# EAGLE design ledhub_r3 (EAGLE 9.6.2)
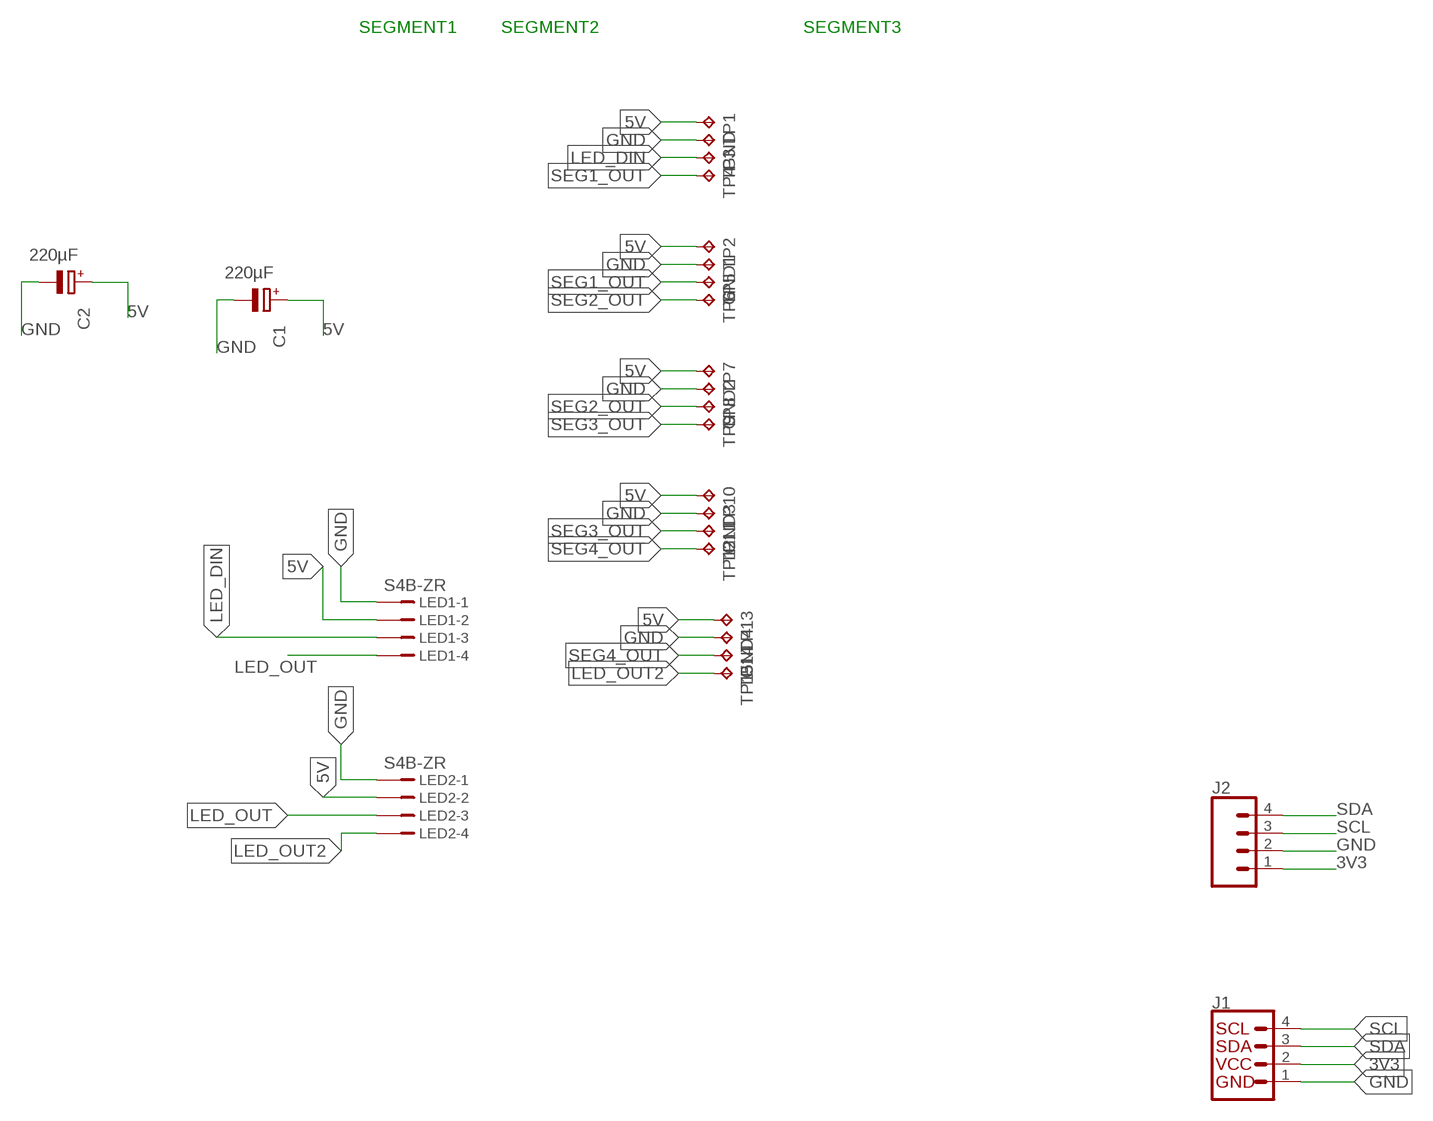
[diagram p0: schematic, sheet 1]

## Parts
C1  220µF  CPOL-EUD  [PANASONIC_D]
C2  220µF  CPOL-EUD  [PANASONIC_D]
GND  TPTP15SQ  [TP15SQ]
GND1  TPTP15SQ  [TP15SQ]
GND2  TPTP15SQ  [TP15SQ]
GND3  TPTP15SQ  [TP15SQ]
GND4  TPTP15SQ  [TP15SQ]
J1  QWIIC_CONNECTORJS-1MM  [1X04_1MM_RA]
J2  CONN_04  [1X04]
LED1  S4B-ZR  [S4B-ZR]
LED2  S4B-ZR  [S4B-ZR]
TP1  TPTP15R  [TP15R]
TP2  TPTP15R  [TP15R]
TP3  TPTP15R  [TP15R]
TP4  TPTP15R  [TP15R]
TP5  TPTP15R  [TP15R]
TP6  TPTP15R  [TP15R]
TP7  TPTP15R  [TP15R]
TP8  TPTP15R  [TP15R]
TP9  TPTP15R  [TP15R]
TP10  TPTP15R  [TP15R]
TP11  TPTP15R  [TP15R]
TP12  TPTP15R  [TP15R]
TP13  TPTP15R  [TP15R]
TP14  TPTP15R  [TP15R]
TP15  TPTP15R  [TP15R]

## Nets
3V3: J1.2(VCC) J2.1
5V: C1.+ C2.+ LED1.2 LED2.2 TP1.TP TP2.TP TP7.TP TP10.TP TP13.TP
GND: C1.- C2.- GND1.TP GND2.TP GND3.TP GND4.TP GND.TP J1.1(GND) J2.2 LED1.1 LED2.1
LED_DIN: LED1.3 TP3.TP
LED_OUT: LED1.4 LED2.3
LED_OUT2: LED2.4 TP15.TP
SCL: J1.4(SCL) J2.3
SDA: J1.3(SDA) J2.4
SEG1_OUT: TP4.TP TP5.TP
SEG2_OUT: TP6.TP TP8.TP
SEG3_OUT: TP9.TP TP11.TP
SEG4_OUT: TP12.TP TP14.TP

## Notes on the sheet
- SEGMENT1 | SEGMENT2 | SEGMENT3

## Library data of the parts
C1 C2 = rcl:CPOL-EU: POLARIZED CAPACITOR, European symbol; SPICEPREFIX: C
GND GND1-GND4 TP1-TP15 = testpad:TP: Test pad
J1 = SparkFun-Connectors:QWIIC_CONNECTOR: SparkFun I2C Standard Qwiic Connector An SMD 1mm pitch JST connector makes it easy and quick (get it? Qwiic?) to connect I2C devices to each other. The Qwiic system <http://www.sparkfun.com/qwiic> enables fast and solderless connection between popular platforms and various sensors and actuators. We carry 200mm <https://www.sparkfun.com/products/14204>, 100mm <https://www.sparkfun.com/products/14205>, 50mm <https://www.sparkfun.com/products/14206>, and breadboard friendly <https://www.sparkfun.com/products/14207> Qwiic cables. We also offer 10 pcs strips <https://www.sparkfun.com/products/14323> the SMD connectors.
J2 = SparkFun-Connectors:CONN_04: Multi connection point. Often used as Generic Header-pin footprint for 0.1 inch spaced/style header connections On any of the 0.1 inch spaced packages, you can populate with these: Break Away Headers - Straight <https://www.sparkfun.com/products/116> (PRT-00116) Break Away Male Headers - Right Angle <https://www.sparkfun.com/products/553> (PRT-00553) Female Headers <https://www.sparkfun.com/products/115> (PRT-00115) Break Away Headers - Machine Pin <https://www.sparkfun.com/products/117> (PRT-00117) Break Away Female Headers - Swiss Machine Pin <https://www.sparkfun.com/products/743> (PRT-00743) For SCREWTERMINALS and SPRING TERMINALS visit here: Screw Terimnals on SparkFun.com <https://www.sparkfun.com/search/results?term=Screw+Terminals> (5mm/3.5mm/2.54mm spacing) This device is also useful as a general connection point to wire up your design to another part of your project. Our various solder wires solder well into these plated through hole pads. Hook-Up Wire - Assortment (Stranded, 22 AWG) <https://www.sparkfun.com/products/11375> (PRT-11375) Hook-Up Wire - Assortment (Solid Core, 22 AWG) <https://www.sparkfun.com/products/11367> (PRT-11367) View the entire wire category on our website here <https://www.sparkfun.com/categories/141> Special notes: Molex polarized connector foot print use with SKU : PRT-08231 with associated crimp pins and housings. 1MM SMD Version SKU: PRT-10208; PROD_ID: CONN-09696
LED1 LED2 = con-jst:?4B-ZR: ZH CONNECTOR 1.5 mm, 4 pin 1 row Source: http://www.jst.com .. eZH.pdf; MF: FARNELL; MPN: S4B-ZR(LF)(SN); OC_FARNELL: 9491830; OC_NEWARK: 38K8076

## Net classes
0 default: width 0.279 mm, clearance 0.229 mm

## Board
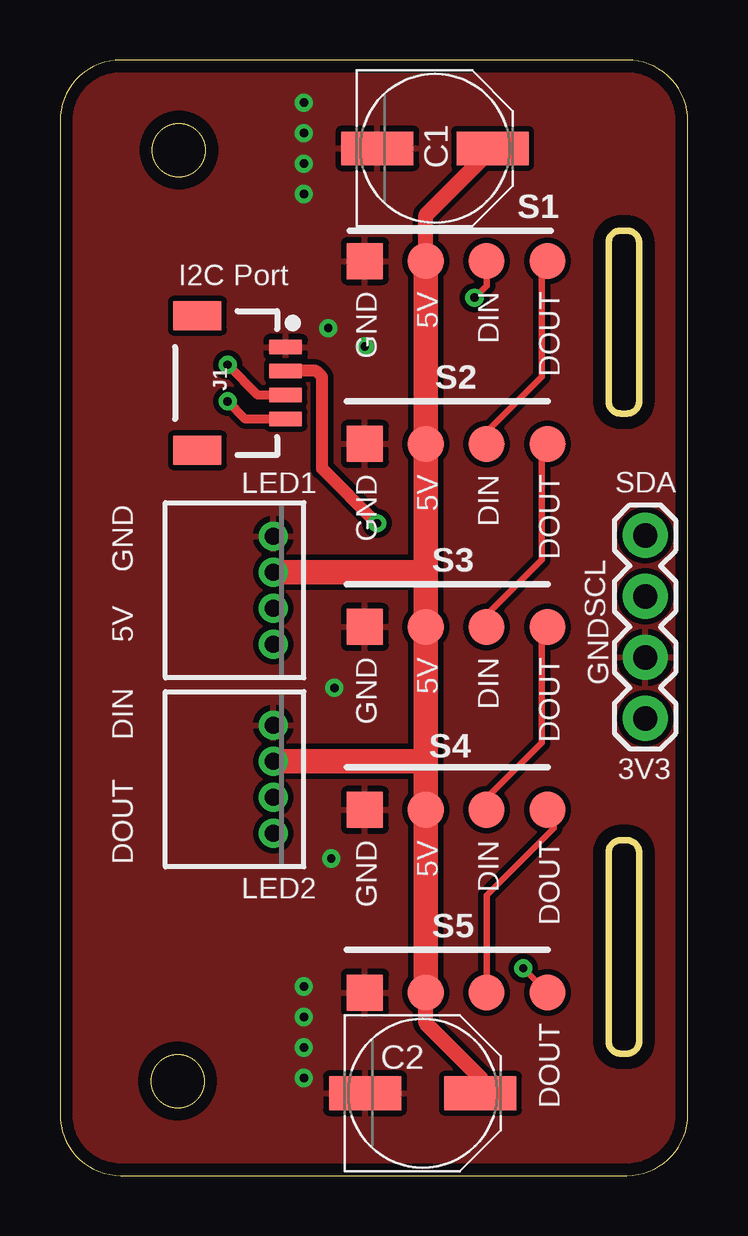
[diagram p1: board, top side]
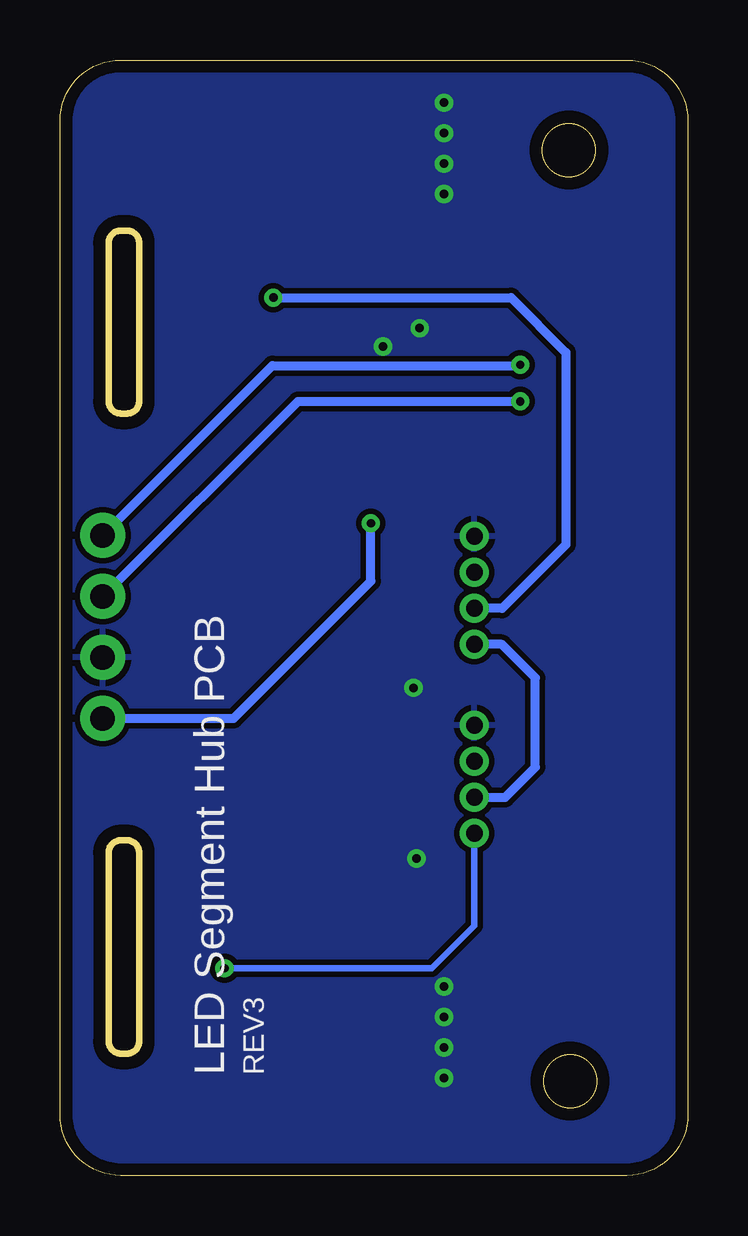
[diagram p2: board, bottom side, seen from below]

Size 26.16 x 46.48 mm. Coordinates in mm from the lower left corner, seen from the top.
Outline: 0,43.94 0,2.54 arc90 2.54,0 23.62,0 arc90 26.16,2.54 26.16,43.94 arc90 23.62,46.48 2.54,46.48 arc90 0,43.94
Outline: 24.13,38.86 24.13,32.26 arc-90 23.62,31.75 23.37,31.75 arc-90 22.86,32.26 22.86,38.86 arc-90 23.37,39.37 23.62,39.37 arc-90 24.13,38.86
Outline: 24.13,13.46 24.13,5.59 arc-90 23.62,5.08 23.37,5.08 arc-90 22.86,5.59 22.86,13.46 arc-90 23.37,13.97 23.62,13.97 arc-90 24.13,13.46
Outline: circle at 4.95,42.72 radius 1.1
Outline: circle at 4.9,3.94 radius 1.1
Copper layers (1*16): Top 0.035mm / dielectric 1.5mm / Bottom 0.035mm
Design rules "default *": minimum track width 6mil, minimum drill 0.35mm, track to track 6mil, track to pad 6mil, pad to pad 6mil, via to via 6mil, smd to smd 6mil, copper to edge 20mil, drill to drill 6mil, minimum pad ring 10mil, minimum via ring 8mil, stop-mask expansion 4mil, vias tented up to drill 2mm, thermal gap 10mil

### Footprints (pad centres in the part's own frame; a part is rotated, then mirrored left to right if it is on the bottom)
PANASONIC_D = smd 3 x 1.4: + 2.4,0; - -2.4,0
TP15SQ = smd 1.5 x 1.5: TP 0,0
1X04_1MM_RA = smd 0.6 x 1.35: 1 -1.5,0; 2 -0.5,0; 3 0.5,0; 4 1.5,0 | smd 1.2 x 2: NC1 2.8,-3.675; NC2 -2.8,-3.675
1X04 = drill 1.016 pad 1.88: 1 0,0; 2 2.54,0; 3 5.08,0; 4 7.62,0
S4B-ZR = drill 0.7 pad 1.1: 1 -2.25,0; 2 -0.75,0; 3 0.75,0; 4 2.25,0
TP15R = smd 1.5 x 1.5: TP 0,0

### Placement (x,y rotation side)
C1  15.62,42.8 0 top
C2  15.11,3.43 0 top
GND  12.7,38.1 0 top
GND1  12.7,30.48 0 top
GND2  12.7,22.86 0 top
GND3  12.7,15.24 0 top
GND4  12.7,7.62 0 top
J1  9.4,33.02 270 top
J2  24.38,19.05 90 top
LED1  8.89,24.38 270 top
LED2  8.89,16.51 270 top
TP1  15.24,38.1 0 top
TP2  15.24,30.48 0 top
TP3  17.78,38.1 0 top
TP4  20.32,38.1 0 top
TP5  17.78,30.48 0 top
TP6  20.32,30.48 0 top
TP7  15.24,22.86 0 top
TP8  17.78,22.86 0 top
TP9  20.32,22.86 0 top
TP10  15.24,15.24 0 top
TP11  17.78,15.24 0 top
TP12  20.32,15.24 0 top
TP13  15.24,7.62 0 top
TP14  17.78,7.62 0 top
TP15  20.32,7.62 0 top

### Tracks (layer width: path | path; a pad name or v marks a point on that pad's centre or on a via)
3V3  (via drill 0.35)
  Top 0.279: J1.2
  Top 0.508: J1.2 10.67,33.53 10.92,33.27 10.92,29.46 v13.21,27.18
  Bottom 0.381: J2.1 18.92,19.05 13.21,24.77 v13.21,27.18
5V
  Top 0.635: TP1.TP 15.24,40.02 C1.+ | C2.+ 17.51,4.08 15.24,6.35 TP13.TP
  Top 1.016: LED1.2 15.1,25.13 15.24,25.27 | LED2.2 15.24,17.26 | 15.24,17.26 TP10.TP TP13.TP | 15.24,17.26 TP7.TP 15.24,25.27 | 15.24,25.27 TP2.TP TP1.TP
GND  (via drill 0.35)
  other vias: 12.7,34.54 10.16,43.43 10.16,42.16 10.16,40.89 10.16,44.7 10.16,7.87 10.16,6.6 10.16,5.33 10.16,4.06 11.43,20.32 11.3,13.21 11.18,35.31
  pour Top: -2.54,48.26 -2.54,-1.27 29.21,-1.27 29.21,48.26
  pour Bottom: 0,46.99 26.67,46.99 26.67,0 0,0
LED_DIN  (via drill 0.35)
  Top 0.279: TP3.TP 17.78,37.08 v17.27,36.58
  Bottom 0.381: v17.27,36.58 7.37,36.58 5.08,34.29 5.08,26.29 7.74,23.63 LED1.3
LED_OUT
  Bottom 0.381: LED2.3 7.61,15.76 6.35,17.02 6.35,20.74 7.75,22.13 LED1.4
LED_OUT2  (via drill 0.35)
  Top 0.279: v19.3,8.64 TP15.TP
  Bottom 0.279: v19.3,8.64 10.67,8.64 8.89,10.41 LED2.4
SCL  (via drill 0.35)
  Top 0.381: J1.4 7.72,31.52 v6.99,32.26
  Bottom 0.381: J2.3 16.24,32.26 v6.99,32.26
SDA  (via drill 0.35)
  Top 0.381: J1.3 8.25,32.52 v6.99,33.78
  Bottom 0.381: J2.4 17.31,33.75 7.02,33.75 v6.99,33.78
SEG1_OUT
  Top 0.279: TP5.TP 17.78,30.99 20.07,33.27 20.07,37.85 TP4.TP
SEG2_OUT
  Top 0.279: TP8.TP 17.78,23.37 20.07,25.65 20.07,30.23 TP6.TP
SEG3_OUT
  Top 0.279: TP11.TP 17.78,15.75 20.07,18.03 20.07,22.61 TP9.TP
SEG4_OUT
  Top 0.279: TP14.TP 17.78,11.68 20.57,14.48 20.57,14.99 TP12.TP

### Text on the board
tNames: S1 | I2C Port | GND | 5V | DIN | DOUT | S2 | GND | 5V | DIN | DOUT | GND | SDA | S3 | 5V | SCL | GND | 5V | DIN | DOUT | DIN | GND | DOUT | S4 | 3V3 | GND | 5V | DIN | DOUT | S5 | DOUT
bNames: REV3 | LED Segment Hub PCB